# Altium schematic sheet m3406.SchDoc
size A4; SheetNumber: 2; SheetTotal: 5; SPICEModelCacheBYMWFIOC: <root> / <DocumentId>BYMWFIOC</DocumentId> / <CacheFrame Number="0"> / <Model Name="fuse" Kind="CKT"> / <Text>.SUBCKT FUSE 1 2 PARAMS: CURRENT=1 RESISTANCE=1m / SW1 1 2 3 0 SMOD OFF / BNLV 3 0 V=(abs(v(1,2))) / .MODEL SMOD SW (VT={(CURRENT*RESISTANCE)} RON=1g ROFF={RESISTANCE}) / .ENDS FUSE</Text> / </Model> / </CacheFrame> / </root>
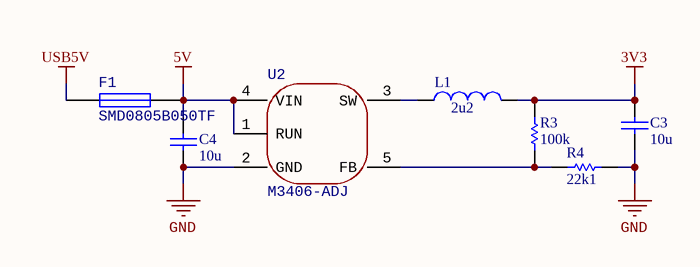
[diagram p0: m3406.SchDoc]

## Parts
C3  value 10u  [CAPC160X80X90L30N]  (hidden comment: Capacitor)
C4  value 10u  [CAPC160X80X90L30N]  (hidden comment: Capacitor)
F1  SMD0805B050TF  [FUSC210X135X125L37N]
L1  value 2u2  [INDC200X160X105L60N]  (hidden comment: Inductor)
R3  value 100k  [RESC100X50X35L25N]  (hidden comment: Resistor)
R4  value 22k1  [RESC100X50X35L25N]  (hidden comment: Resistor)
U2  M3406-ADJ  [SOT23-5P95_280X110L37X40N]

## Nets
3V3: C3.2 L1.2 R3.2
5V: C4.2 F1.2 U2.1(RUN) U2.4(VIN)
GND: C3.1 C4.1 R4.1 U2.2(GND)
USB5V: F1.1
NetL1_1: L1.1 U2.3(SW)
NetR3_1: R3.1 R4.2 U2.5(FB)

## Library data of the parts
C3 C4 = GRM188R61E106KA73D: MPN: TCC0603X5R106K100CT; Manufacturer: CCTC(三环); 编号: C380314; Case/Package: 0603; Mounting Type: SMD
F1 = Fuse 1: Fuse; 编号: C269104
L1 = WPN201610U2R2MTY01: MPN: SFE201610-2R2M; Manufacturer: DDY(德立); 编号: C5159659; Case/Package: 201610; Mounting Type: SMD
R3 = RC0402FR-07100KL: MPN: RTT021003FTH; Manufacturer: RALEC(旺诠); 编号: C102750; Case/Package: 0402; Mounting Type: SMD
R4 = RC0402FR-0722K1L: MPN: RTT022212FTH; Manufacturer: RALEC(旺诠); 编号: C102896; Case/Package: 0402; Mounting Type: SMD
U2 = M3406-ADJ: Vin=2V~6V,800mA,DCDC; Manufacturer: 西安航天民芯; 编号: C83224; MPN: M3406-ADJ; Mounting Type: SMD